# EAGLE design Hoov_Fuzz (EAGLE 9.5.2)
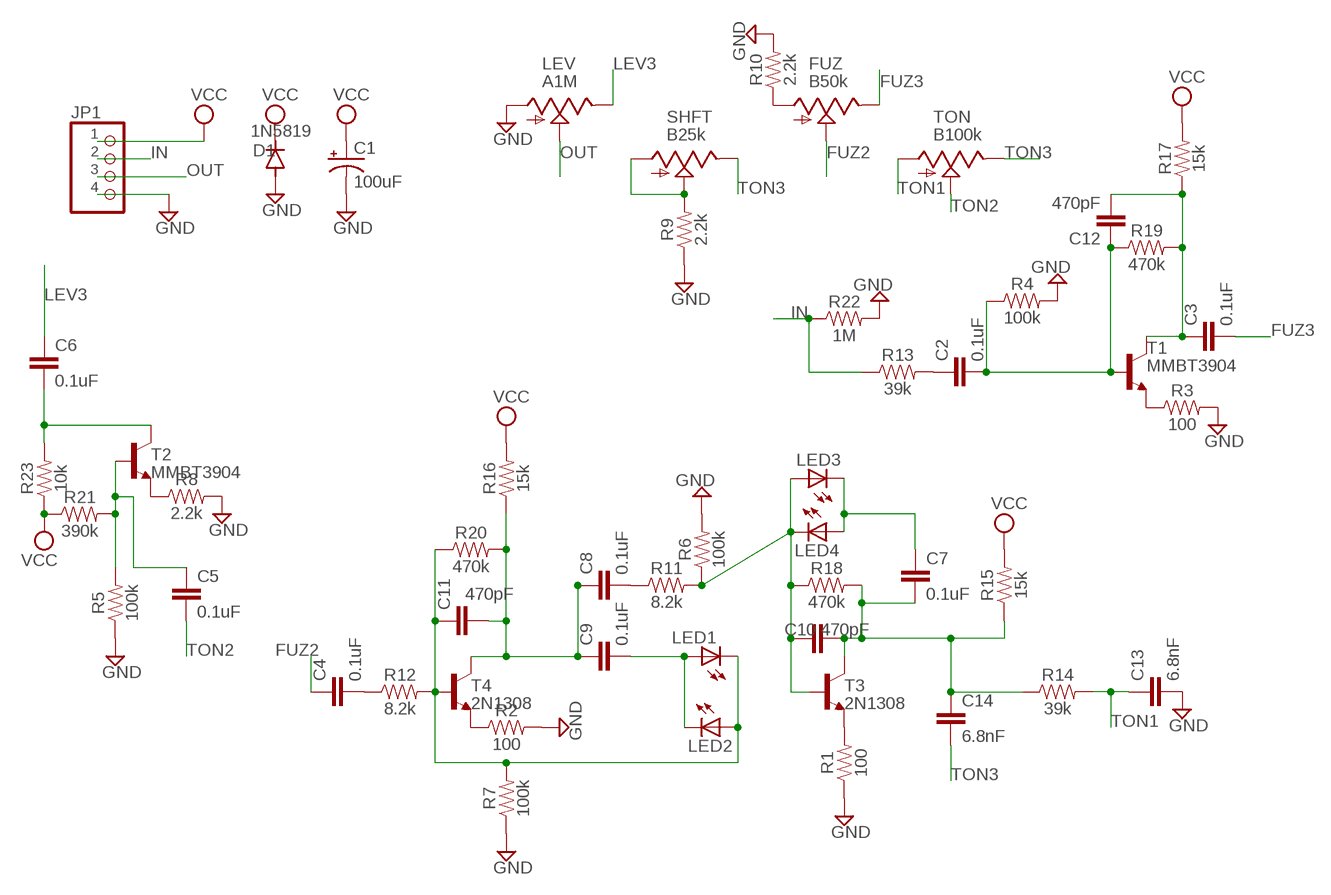
[diagram p0: schematic, sheet 1]

## Parts
C1  100uF  CAP_SMD+THRUPAN_B  [PAN_B_SMD+THRU]
C2  0.1uF  0.1UF-0603-25V-(+80/-20%)  [0603]
C3  0.1uF  0.1UF-0603-25V-(+80/-20%)  [0603]
C4  0.1uF  0.1UF-0603-25V-(+80/-20%)  [0603]
C5  0.1uF  0.1UF-0603-25V-(+80/-20%)  [0603]
C6  0.1uF  0.1UF-0603-25V-(+80/-20%)  [0603]
C7  0.1uF  0.1UF-0603-25V-(+80/-20%)  [0603]
C8  0.1uF  0.1UF-0603-25V-(+80/-20%)  [0603]
C9  0.1uF  0.1UF-0603-25V-(+80/-20%)  [0603]
C10  470pF  470PF-0603-50V-5%  [0603]
C11  470pF  470PF-0603-50V-5%  [0603]
C12  470pF  470PF-0603-50V-5%  [0603]
C13  6.8nF  470PF-0603-50V-5%  [0603]
C14  6.8nF  470PF-0603-50V-5%  [0603]
D1  1N5819  DIODE-SOD123  [SOD123]
FUZ  B50k  9MM_SNAP-IN_POT_  [9MM_SNAP-IN_POT]
JP1  PINHD-1X4  [1X04]
LED1  LED_E  [LED_1206]
LED2  LED_E  [LED_1206]
LED3  LED_E  [LED_1206]
LED4  LED_E  [LED_1206]
LEV  A1M  9MM_SNAP-IN_POT_  [9MM_SNAP-IN_POT]
R1  100  100OHM-0603-1/4W-5%  [0603]
R2  100  100OHM-0603-1/4W-5%  [0603]
R3  100  100OHM-0603-1/4W-5%  [0603]
R4  100k  100KOHM-0603-1/10W-1%  [0603]
R5  100k  100KOHM-0603-1/10W-1%  [0603]
R6  100k  100KOHM-0603-1/10W-1%  [0603]
R7  100k  100KOHM-0603-1/10W-1%  [0603]
R8  2.2k  2.2KOHM-0603-1/10W-1%  [0603]
R9  2.2k  2.2KOHM-0603-1/10W-1%  [0603]
R10  2.2k  2.2KOHM-0603-1/10W-1%  [0603]
R11  8.2k  8.2KOHM-0603-1/10W-5%  [0603]
R12  8.2k  8.2KOHM-0603-1/10W-5%  [0603]
R13  39k  39KOHM-0603-1/10W-1%  [0603]
R14  39k  39KOHM-0603-1/10W-1%  [0603]
R15  15k  15KOHM-0603-1/10W-1%  [0603]
R16  15k  15KOHM-0603-1/10W-1%  [0603]
R17  15k  15KOHM-0603-1/10W-1%  [0603]
R18  470k  RESISTOR0603  [0603]
R19  470k  RESISTOR0603  [0603]
R20  470k  RESISTOR0603  [0603]
R21  390k  390KOHM-0603-1/10W-1%  [0603]
R22  1M  1MOHM-0603-1/4W-5%  [0603]
R23  10k  10KOHM-0603-1/10W-1%  [0603]
SHFT  B25k  9MM_SNAP-IN_POT_  [9MM_SNAP-IN_POT]
T1  MMBT3904  BC817-16LT1-NPN-SOT23-BEC  [SOT23-BEC]
T2  MMBT3904  BC817-16LT1-NPN-SOT23-BEC  [SOT23-BEC]
T3  2N1308  -NPN-TO5  [TO5]
T4  2N1308  -NPN-TO5  [TO5]
TON  B100k  9MM_SNAP-IN_POT_  [9MM_SNAP-IN_POT]

## Nets
FUZ2: C4.1 FUZ.2(S)
FUZ3: C3.2 FUZ.3(E)
GND: C1.- C1.--(-) C13.2 D1.A JP1.4 LEV.1(A) R1.1 R2.2 R3.2 R4.2 R5.1 R6.2 R7.1 R8.2 R9.1 R10.2 R22.2
IN: JP1.2 R13.1 R22.1
LEV3: C6.1 LEV.3(E)
N$1: R9.2 SHFT.1(A) SHFT.2(S)
N$2: C2.1 R13.2
N$3: C2.2 C12.1 R4.1 R19.1 T1.B
N$4: FUZ.1(A) R10.1
N$5: C3.1 C12.2 R17.1 R19.2 T1.C
N$6: R3.1 T1.E
N$7: C4.2 R12.1
N$8: R2.1 T4.1(E)
N$9: C9.2 LED1.A LED2.C
N$10: C8.1 C9.1 C11.2 R16.1 R20.2 T4.3(C)
N$11: C11.1 LED1.C LED2.A R7.2 R12.2 R20.1 T4.2(B)
N$12: C8.2 R11.1
N$13: C10.1 LED3.A LED4.C R6.1 R11.2 R18.1 T3.2(B)
N$14: C7.2 C10.2 C14.1 R14.1 R15.1 R18.2 T3.3(C)
N$15: R1.2 T3.1(E)
N$16: C7.1 LED3.C LED4.A
N$17: C5.1 R5.2 R21.2 T2.B
N$18: C6.2 R23.2 T2.C
N$19: R8.1 T2.E
OUT: JP1.3 LEV.2(S)
TON1: C13.1 R14.2 TON.1(A)
TON2: C5.2 TON.2(S)
TON3: C14.2 SHFT.3(E) TON.3(E)
VCC: C1.+ C1.++(+) D1.C JP1.1 R15.2 R16.2 R17.2 R21.1 R23.1

## Library data of the parts
C1 = MusicThingModular:CAP_SMD+THRU
C2-C9 = SparkFun-Capacitors:0.1UF: 0.1µF ceramic capacitors A capacitor is a passive two-terminal electrical component used to store electrical energy temporarily in an electric field.; PROD_ID: CAP-00810
C10-C12 = SparkFun-Capacitors:470PF: 470pF ceramic capacitors A capacitor is a passive two-terminal electrical component used to store electrical energy temporarily in an electric field.; PROD_ID: CAP-07884
C13 C14 = SparkFun-Capacitors:470PF: 470pF ceramic capacitors A capacitor is a passive two-terminal electrical component used to store electrical energy temporarily in an electric field.; PROD_ID: CAP-07884; VALUE: 470pF
D1 = diode:DIODE-: DIODE
FUZ LEV SHFT TON = MusicThingModular:9MM_SNAP-IN_POT: 9mm vertical snap-in pot, Alpha / Panasonic style
JP1 = Connector:PINHD-1X4: PIN HEADER; CATEGORY: CONNECTOR; SUB-CATEGORY: PIN-HEADER
LED1-LED4 = eagle-ltspice:LED_E: LED Source: http://www.osram.convergy.de Source: www.luxeon.com Source: www.kingbright.com; SPICEMODEL: NONE; SPICEPREFIX: D; SPICETYPE: diode
R1-R3 = SparkFun-Resistors:100OHM: 100Ω resistor A resistor is a passive two-terminal electrical component that implements electrical resistance as a circuit element. Resistors act to reduce current flow, and, at the same time, act to lower voltage levels within circuits. - Wikipedia; PROD_ID: RES-12438
R4-R7 = SparkFun-Resistors:100KOHM: 100kΩ resistor A resistor is a passive two-terminal electrical component that implements electrical resistance as a circuit element. Resistors act to reduce current flow, and, at the same time, act to lower voltage levels within circuits. - Wikipedia; PROD_ID: RES-07828
R8-R10 = SparkFun-Resistors:2.2KOHM: 2.2kΩ resistor A resistor is a passive two-terminal electrical component that implements electrical resistance as a circuit element. Resistors act to reduce current flow, and, at the same time, act to lower voltage levels within circuits. - Wikipedia; PROD_ID: RES-08272
R11 R12 = SparkFun-Resistors:8.2KOHM: 8.2kΩ resistor A resistor is a passive two-terminal electrical component that implements electrical resistance as a circuit element. Resistors act to reduce current flow, and, at the same time, act to lower voltage levels within circuits. - Wikipedia; PROD_ID: RES-10646
R13 R14 = SparkFun-Resistors:39KOHM: 39kΩ resistor A resistor is a passive two-terminal electrical component that implements electrical resistance as a circuit element. Resistors act to reduce current flow, and, at the same time, act to lower voltage levels within circuits. - Wikipedia; PROD_ID: RES-12377
R15-R17 = SparkFun-Resistors:15KOHM: 15kΩ resistor A resistor is a passive two-terminal electrical component that implements electrical resistance as a circuit element. Resistors act to reduce current flow, and, at the same time, act to lower voltage levels within circuits. - Wikipedia; PROD_ID: RES-07854
R18-R20 = SparkFun-Resistors:RESISTOR: Generic Resistor Package
R21 = SparkFun-Resistors:390KOHM: 390kΩ resistor A resistor is a passive two-terminal electrical component that implements electrical resistance as a circuit element. Resistors act to reduce current flow, and, at the same time, act to lower voltage levels within circuits. - Wikipedia; PROD_ID: RES-12024
R22 = SparkFun-Resistors:1MOHM: 1MΩ resistor A resistor is a passive two-terminal electrical component that implements electrical resistance as a circuit element. Resistors act to reduce current flow, and, at the same time, act to lower voltage levels within circuits. - Wikipedia; PROD_ID: RES-07868
R23 = SparkFun-Resistors:10KOHM: 10kΩ resistor A resistor is a passive two-terminal electrical component that implements electrical resistance as a circuit element. Resistors act to reduce current flow, and, at the same time, act to lower voltage levels within circuits. - Wikipedia; PROD_ID: RES-00824
T1-T4 = MusicThingModular:*-NPN-: NPN Transistror BF959 corrected 2008.03.06

## Board
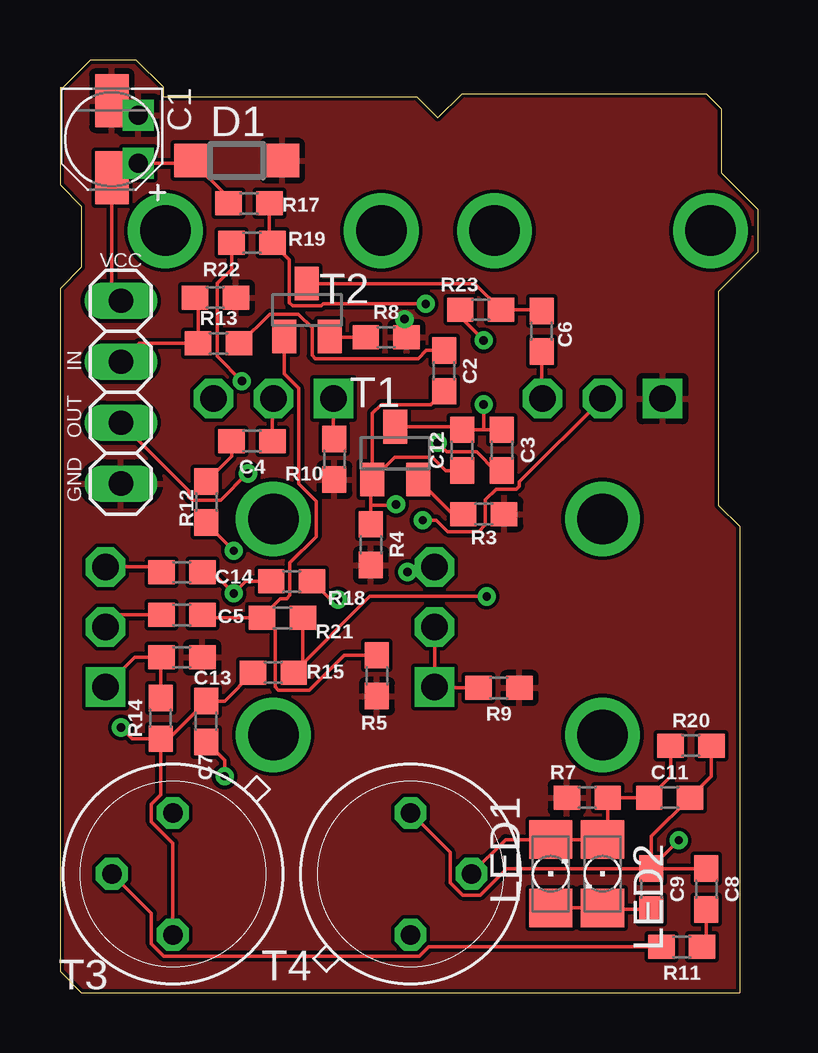
[diagram p1: board, top side]
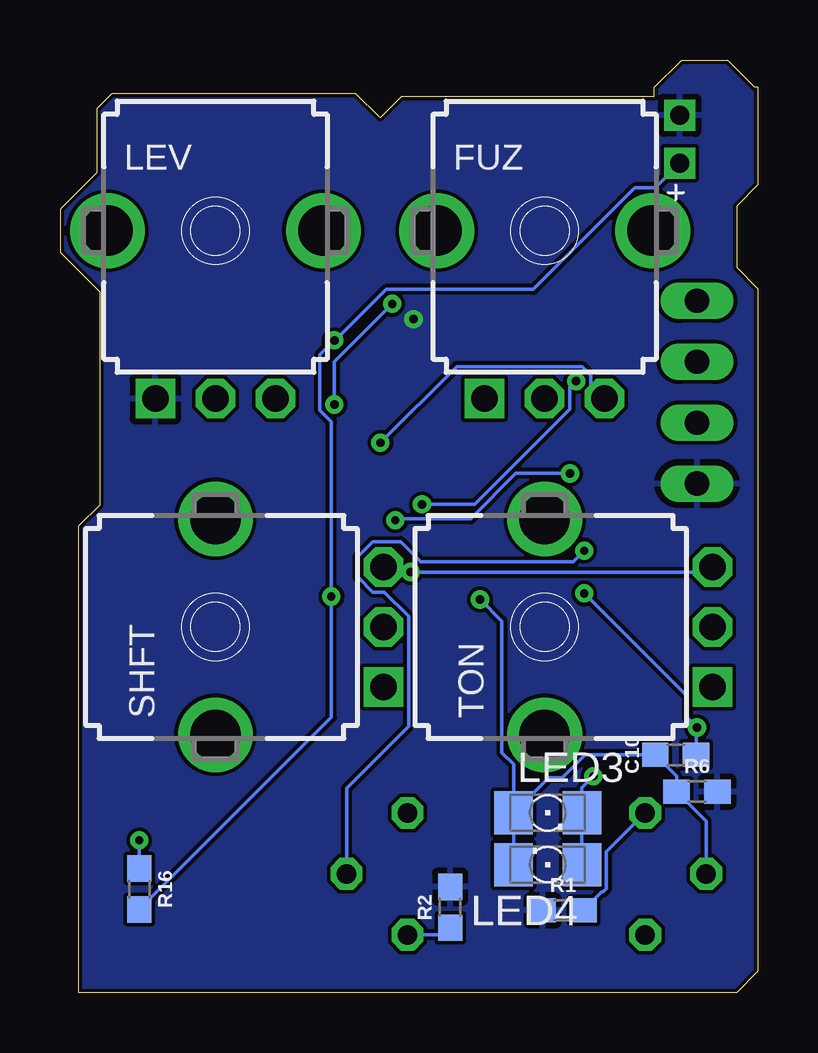
[diagram p2: board, bottom side, seen from below]

Size 29.08 x 38.86 mm. Coordinates in mm from the lower left corner, seen from the top.
Outline: 0.89,0 28.32,0 28.32,19.43 27.43,20.32 27.43,29.21 29.08,30.86 29.08,32.64 27.56,34.16 27.56,36.83 26.92,37.47 16.76,37.47 15.75,36.45 14.86,37.34 4.32,37.34 4.32,37.72 3.17,38.86 1.27,38.86 0.13,37.72 0,37.72 0,33.66 0.89,32.77 0.89,30.23 0,29.34 0,0.89 0.89,0
Copper layers (1*16): Top 0.035mm / dielectric 1.5mm / Bottom 0.035mm
Design rules "default *": minimum track width 6mil, minimum drill 0.35mm, track to track 6mil, track to pad 6mil, pad to pad 6mil, via to via 6mil, smd to smd 6mil, copper to edge 6mil, drill to drill 6mil, minimum pad ring 10mil, minimum via ring 8mil, stop-mask expansion 4mil, vias tented up to drill 0mil, thermal gap 10mil

### Footprints (pad centres in the part's own frame; a part is rotated, then mirrored left to right if it is on the bottom)
PAN_B_SMD+THRU = smd 2.2 x 1.4: + 1.6,0; - -1.6,0 | drill 0.8 pad 0.9 square: ++ 1,1.1; -- -1,1.1
0603 = smd 1.1 x 1: 1 -0.85,0; 2 0.85,0
SOD123 = smd 1.4 x 1.4: A 1.9,0; C -1.9,0
9MM_SNAP-IN_POT = drill 1.1 square: 1 -2.5,-7 | drill 1.1 octagon: 2 0,-7; 3 2.5,-7 | drill 2.1 pad 2.794: CHASSIS1 -4.5,0; CHASSIS2 4.5,0
1X04 = drill 1.016 long: 1 -3.81,0; 2 -1.27,0; 3 1.27,0; 4 3.81,0
LED_1206 = smd 1.6 x 1.803: A -1.422,0; C 1.422,0
SOT23-BEC = smd 1 x 1.4: B -0.95,-1.1; C 0,1.1; E 0.95,-1.1
TO5 = drill 0.813 octagon: 1 0,-2.54; 2 2.54,0; 3 0,2.54

### Placement (x,y rotation side)
C1  2.16,35.56 270 top
C2  16,25.91 270 top
C3  18.41,22.61 270 top
C4  8,22.99 180 top
C5  5.08,15.75 180 top
C6  20.07,27.56 90 top
C7  6.1,11.3 90 top
C8  26.92,4.32 270 top
C9  24.64,4.32 270 top
C10  3.43,9.91 0 bottom
C11  25.4,8.13 0 top
C12  16.76,22.61 90 top
C13  5.08,13.97 0 top
C14  5.08,17.53 180 top
D1  7.37,34.67 0 top
FUZ  8.89,31.75 0 bottom
JP1  2.54,25.02 270 top
LED1  20.45,4.95 90 top
LED2  22.61,4.95 270 top
LED3  8.76,7.49 0 bottom
LED4  8.76,5.33 180 bottom
LEV  22.61,31.75 0 bottom
R1  8.13,3.43 0 bottom
R2  12.83,3.56 90 bottom
R3  17.65,19.94 0 top
R4  12.95,18.67 270 top
R5  13.21,13.21 90 top
R6  2.54,8.38 0 bottom
R7  21.97,8.13 0 top
R8  13.59,27.3 0 top
R9  18.29,12.7 180 top
R10  11.43,22.23 270 top
R11  25.91,1.91 180 top
R12  6.1,20.45 270 top
R13  6.6,27.05 0 top
R14  4.19,11.43 90 top
R15  8.89,13.34 0 top
R16  25.78,4.32 270 bottom
R17  7.87,32.89 180 top
R18  9.65,17.14 180 top
R19  8,31.24 0 top
R20  26.29,10.29 0 top
R21  9.27,15.62 180 top
R22  6.48,28.96 0 top
R23  17.53,28.45 0 top
SHFT  22.61,15.24 90 bottom
T1  13.97,22.48 0 top
T2  10.29,28.45 0 top
T3  4.7,4.95 180 top
T4  14.61,4.95 0 top
TON  8.89,15.24 90 bottom

### Tracks (layer width: path | path; a pad name or v marks a point on that pad's centre or on a via)
FUZ2
  Top 0.152: C4.1 8.85,24.71 FUZ.2
FUZ3  (via drill 0.35)
  Top 0.152: v15.73,22.91 16.11,22.54 17.36,22.54 18.14,21.76 C3.2
  Bottom 0.152: FUZ.3 6.97,25.33 6.97,25.73 7.32,26.09 12.56,26.09 v15.73,22.91
GND  (via drill 0.35)
  Top 0.152: R8.2 14.35,27.39 v14.35,28.07
  pour Bottom (isolate 0.127): -1.65,39.24 -1.65,-0.76 -1.4,-1.02 29.59,-1.02 30.23,-0.38 30.23,38.73 30.35,38.86 -1.27,38.86
  pour Top (isolate 0.127): -1.14,39.75 -1.14,0.38 0.38,-1.14 27.81,-1.14 29.59,0.64 29.59,37.34 28.45,38.48 27.18,39.75
IN
  Top 0.152: JP1.2 3.3,27.05 R13.1 5.75,28.83 R22.1
LEV3
  Top 0.152: C6.1 20.07,24.79 LEV.3
N$1
  Top 0.152: R9.2 15.65,12.7 SHFT.1 SHFT.2
N$2
  Top 0.152: R13.2 7.52,27.05 8.74,28.28 9.93,28.28 10.51,27.7 10.51,26.55 10.64,26.42 14.93,26.42 15.27,26.76 C2.1
N$3  (via drill 0.35)
  Top 0.152: C2.2 15.45,24.51 13.38,24.51 13.02,24.15 T1.B | C12.1 16.07,21.76 15.52,22.31 13.95,22.31 T1.B | R4.1 12.95,20.32 | 12.95,20.32 12.95,21.31 T1.B | R19.1 7.15,30.15 6.55,29.55 6.55,26.51 v7.58,25.48 | v14,20.35 13.97,20.32 12.95,20.32
  Bottom 0.152: v7.58,25.48 7.84,25.22 7.84,24.31 11.8,20.35 v14,20.35
N$4
  Top 0.152: FUZ.1 11.39,23.11 R10.1
N$5  (via drill 0.35)
  Top 0.152: R17.1 8.72,31.37 R19.2 9.56,30.54 9.56,28.75 9.69,28.62 10.88,28.62 10.96,28.7 v15.24,28.7 | T1.C 16.64,23.58 C12.2 17.65,23.46 | 17.65,23.46 C3.1 | v17.65,24.51 17.65,23.46
  Bottom 0.152: v15.24,28.7 17.65,26.29 v17.65,24.51
N$6
  Top 0.152: T1.E 16.36,19.94 R3.1
N$7
  Top 0.152: C4.2 7.15,22.35 R12.1
N$8
  Bottom 0.152: R2.1 13.12,2.41 T4.1
N$9
  Top 0.152: LED1.A LED2.C 22.67,3.47 C9.2
N$10  (via drill 0.35)
  Top 0.152: R20.2 27.14,9.02 C11.2 24.64,6.52 24.64,5.21 | 24.64,5.21 C9.1 | C9.1 C8.1 | v25.78,6.35 24.64,5.21 | T4.3 16.26,5.84 16.26,4.58 16.78,4.06 17.51,4.06 18.62,5.17 C9.1
  Bottom 0.152: R16.1 v25.78,6.35
N$11  (via drill 0.35)
  Top 0.152: R20.1 25.44,9.02 C11.1 R7.2 22.82,6.59 LED2.A LED1.C 18.57,6.38 T4.2 | v7.24,18.41 6.1,19.56 R12.2
  Bottom 0.152: T4.2 17.14,8.51 14.55,11.1 14.55,15.68 15.56,16.69 16.04,16.69 16.66,17.3 16.66,18.18 16.04,18.79 14.89,18.79 14.05,17.95 7.7,17.95 v7.24,18.41
N$12
  Top 0.152: C8.2 26.92,2.07 R11.1
N$13  (via drill 0.35)
  Top 0.152: R11.2 15.35,1.91 14.97,1.52 4.33,1.52 3.81,2.04 3.81,3.3 T3.2 | R18.1 11.26,16.38 v11.58,16.38
  Bottom 0.152: T3.2 2.16,7.15 R6.1 3.39,9.02 C10.1 7.2,9.91 8.15,8.95 8.72,8.95 LED3.A | LED3.A LED4.C | LED3.A 10.19,9.51 10.68,10 10.68,15.48 v11.58,16.38
N$14  (via drill 0.35)
  Top 0.152: T3.3 4.7,6.24 3.81,7.12 3.81,7.86 4.19,8.24 4.19,10.41 | 4.19,10.41 R14.1 3.01,10.58 v2.54,11.05 | R18.2 7.75,17.14 v7.24,16.64 6.35,17.53 C14.1 | R15.1 6.86,12.15 C7.2 4.36,10.41 4.19,10.41
  Bottom 0.152: C10.2 2.58,11.01 v2.54,11.05 2.94,11.45 2.94,12.34 v7.24,16.64
N$15
  Bottom 0.152: T3.1 6.31,5.88 6.31,4.34 6.45,4.2 6.5,4.2 R1.2
N$16  (via drill 0.35)
  Top 0.152: C7.1 6.86,9.69 v6.86,9.02
  Bottom 0.152: LED4.A LED3.C 7.34,8.53 v6.86,9.02
N$17
  Top 0.152: R21.2 8.38,15.62 | 8.38,15.62 6.06,15.62 C5.1 | T2.B 9.34,25.79 9.94,25.19 9.94,21.21 10.68,20.48 10.68,19 9.58,17.9 9.58,16.55 9.45,16.42 9.18,16.42 8.45,15.68 | 8.45,15.68 8.38,15.62 | R5.2 11.84,14.06 10.38,12.61 9.1,12.61 8.96,12.74 8.96,15.17 8.45,15.68
N$18
  Top 0.152: T2.C 17.28,29.55 R23.2 20.03,28.45 C6.2
N$19
  Top 0.152: T2.E 11.28,27.3 R8.1
OUT  (via drill 0.35)
  Top 0.152: JP1.3 5.37,20.92 5.37,20.65 5.5,20.52 6.69,20.52 7.81,21.63 v7.83,21.63 | LEV.2 19.14,21.29 19.14,21.11 19.01,20.98 18.17,20.98 17.72,20.53 17.72,19.49 17.45,19.21 16.16,19.21 15.68,19.68 v15.11,19.68
  Bottom 0.152: v7.83,21.63 10.09,21.63 11.98,19.74 15.05,19.74 v15.11,19.68
TON1
  Top 0.152: TON.1 3.12,13.97 C13.1 4.19,13.93 R14.2
TON2
  Top 0.152: TON.2 2.4,15.75 C5.2
TON3  (via drill 0.35)
  Top 0.152: TON.3 4.02,17.74 C14.2 | SHFT.3 14.69,17.74 v14.48,17.53
  Bottom 0.152: v14.48,17.53 2.1,17.53 TON.3
VCC  (via drill 0.35)
  Top 0.152: JP1.1 2.16,29.21 C1.+ 2.76,34.56 C1.++ 5.36,34.56 D1.C 7.02,33.11 R17.2 | v17.65,27.18 16.68,28.16 R23.1 | R21.1 10.12,13.72 R15.2 12.91,16.51 v17.78,16.51
  Bottom 0.152: C1.++ 4.28,33.54 5.13,33.54 9.36,29.31 15.49,29.31 17.62,27.18 v17.65,27.18 18.26,26.57 18.26,24.26 17.78,23.78 v17.78,16.51 17.78,11.47 R16.2

### Text on the board
tPlace: VCC | IN | OUT | GND